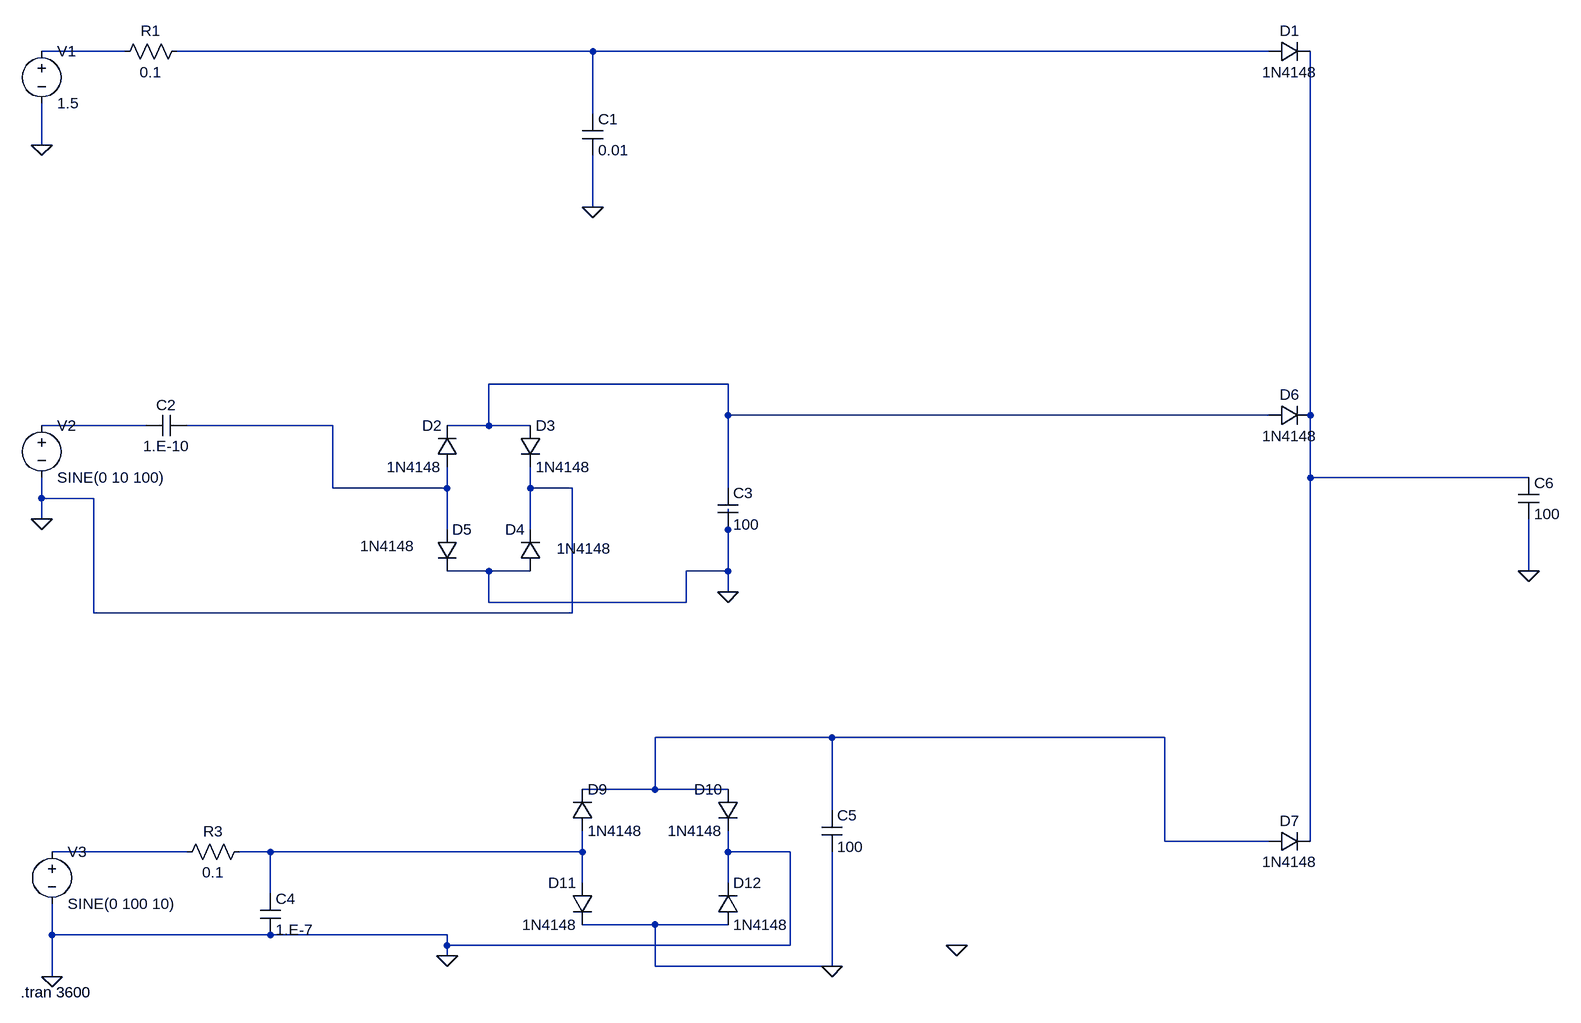
[diagram p0: schematic power out.asc]
power out.asc, the LTspice schematic file:
Version 4
SHEET 1 2184 1656
WIRE -32 192 -160 192
WIRE 688 192 48 192
WIRE 1728 192 688 192
WIRE 688 288 688 192
WIRE -160 336 -160 272
WIRE 688 432 688 352
WIRE 896 704 528 704
WIRE 896 752 896 704
WIRE 1728 752 896 752
WIRE 1792 752 1792 192
WIRE 0 768 -160 768
WIRE 288 768 64 768
WIRE 528 768 528 704
WIRE 528 768 464 768
WIRE 592 768 528 768
WIRE 1792 848 1792 752
WIRE 2128 848 1792 848
WIRE 288 864 288 768
WIRE 464 864 464 832
WIRE 464 864 288 864
WIRE 592 864 592 832
WIRE 656 864 592 864
WIRE 896 864 896 752
WIRE -160 880 -160 848
WIRE -80 880 -160 880
WIRE -160 912 -160 880
WIRE 464 928 464 864
WIRE 592 928 592 864
WIRE 896 928 896 896
WIRE 528 992 464 992
WIRE 592 992 528 992
WIRE 896 992 896 928
WIRE 896 992 832 992
WIRE 2128 992 2128 912
WIRE 896 1024 896 992
WIRE 528 1040 528 992
WIRE 832 1040 832 992
WIRE 832 1040 528 1040
WIRE -80 1056 -80 880
WIRE 656 1056 656 864
WIRE 656 1056 -80 1056
WIRE 1056 1248 784 1248
WIRE 1568 1248 1056 1248
WIRE 784 1328 784 1248
WIRE 784 1328 672 1328
WIRE 896 1328 784 1328
WIRE 1056 1360 1056 1248
WIRE 1568 1408 1568 1248
WIRE 1728 1408 1568 1408
WIRE 1792 1408 1792 848
WIRE 64 1424 -144 1424
WIRE 192 1424 144 1424
WIRE 672 1424 672 1392
WIRE 672 1424 192 1424
WIRE 896 1424 896 1392
WIRE 992 1424 896 1424
WIRE 672 1472 672 1424
WIRE 896 1472 896 1424
WIRE 192 1488 192 1424
WIRE 784 1536 672 1536
WIRE 896 1536 784 1536
WIRE -144 1552 -144 1504
WIRE 192 1552 -144 1552
WIRE 464 1552 192 1552
WIRE 464 1568 464 1552
WIRE 992 1568 992 1424
WIRE 992 1568 464 1568
WIRE 464 1584 464 1568
WIRE 784 1600 784 1536
WIRE 1056 1600 1056 1424
WIRE 1056 1600 784 1600
WIRE -144 1616 -144 1552
FLAG 688 432 0
FLAG -160 336 0
FLAG -160 912 0
FLAG 896 1024 0
FLAG -144 1616 0
FLAG 464 1584 0
FLAG 1056 1600 0
FLAG 1248 1568 0
FLAG 2128 992 0
SYMBOL voltage -160 176 R0
WINDOW 123 0 0 Left 0
WINDOW 39 0 0 Left 0
SYMATTR InstName V1
SYMATTR Value 1.5
SYMBOL res 64 176 R90
WINDOW 0 0 56 VBottom 2
WINDOW 3 32 56 VTop 2
SYMATTR InstName R1
SYMATTR Value 0.1
SYMBOL cap 672 288 R0
SYMATTR InstName C1
SYMATTR Value 0.01
SYMBOL voltage -160 752 R0
WINDOW 123 24 124 Left 2
WINDOW 39 0 0 Left 0
SYMATTR InstName V2
SYMATTR Value SINE(0 10 100)
SYMBOL cap 64 752 R90
WINDOW 0 0 32 VBottom 2
WINDOW 3 32 32 VTop 2
SYMATTR InstName C2
SYMATTR Value 1.E-10
SYMBOL diode 480 832 R180
WINDOW 0 24 64 Left 2
WINDOW 3 24 0 Left 2
SYMATTR InstName D2
SYMATTR Value 1N4148
SYMBOL diode 576 768 R0
SYMATTR InstName D3
SYMATTR Value 1N4148
SYMBOL diode 608 992 R180
WINDOW 0 24 64 Left 2
WINDOW 3 -109 35 Left 2
SYMATTR InstName D4
SYMATTR Value 1N4148
SYMBOL diode 448 928 R0
WINDOW 3 -118 25 Left 2
SYMATTR Value 1N4148
SYMATTR InstName D5
SYMBOL cap 880 864 R0
SYMATTR InstName C3
SYMATTR Value 100
SYMBOL voltage -144 1408 R0
WINDOW 123 0 0 Left 0
WINDOW 39 0 0 Left 0
SYMATTR InstName V3
SYMATTR Value SINE(0 100 10)
SYMBOL res 160 1408 R90
WINDOW 0 0 56 VBottom 2
WINDOW 3 32 56 VTop 2
SYMATTR InstName R3
SYMATTR Value 0.1
SYMBOL cap 176 1488 R0
SYMATTR InstName C4
SYMATTR Value 1.E-7
SYMBOL diode 656 1392 M180
WINDOW 0 24 64 Left 2
WINDOW 3 24 0 Left 2
SYMATTR InstName D9
SYMATTR Value 1N4148
SYMBOL diode 912 1328 M0
SYMATTR InstName D10
SYMATTR Value 1N4148
SYMBOL diode 688 1472 M0
SYMATTR InstName D11
SYMATTR Value 1N4148
SYMBOL diode 880 1536 M180
WINDOW 0 24 64 Left 2
WINDOW 3 24 0 Left 2
SYMATTR InstName D12
SYMATTR Value 1N4148
SYMBOL diode 1728 208 R270
WINDOW 0 32 32 VTop 2
WINDOW 3 0 32 VBottom 2
SYMATTR InstName D1
SYMATTR Value 1N4148
SYMBOL diode 1728 768 R270
WINDOW 0 32 32 VTop 2
WINDOW 3 0 32 VBottom 2
SYMATTR InstName D6
SYMATTR Value 1N4148
SYMBOL diode 1728 1424 R270
WINDOW 0 32 32 VTop 2
WINDOW 3 0 32 VBottom 2
SYMATTR InstName D7
SYMATTR Value 1N4148
SYMBOL cap 1040 1360 R0
SYMATTR InstName C5
SYMATTR Value 100
SYMBOL cap 2112 848 R0
SYMATTR InstName C6
SYMATTR Value 100
SYMATTR SpiceLine V=5
TEXT -192 1640 Left 2 !.tran 3600

The netlist it stands for:
* power out.asc
V1 N001 0 1.5
R1 N002 N001 0.1
C1 N002 0 0.01
V2 N005 0 SINE(0 10 100)
C2 N006 N005 1.E-10
D2 N006 N003 1N4148
D3 N003 0 1N4148
D4 0 0 1N4148
D5 N006 0 1N4148
C3 N003 0 100
V3 N008 0 SINE(0 100 10)
R3 N009 N008 0.1
C4 N009 0 1.E-7
D9 N009 N007 1N4148
D10 N007 0 1N4148
D11 N009 0 1N4148
D12 0 0 1N4148
D1 N002 N004 1N4148
D6 N003 N004 1N4148
D7 N007 N004 1N4148
C5 N007 0 100
C6 N004 0 100 V=5
.model D D
.lib standard.dio
.tran 3600
.backanno
.end